# Altium schematic sheet Alimentacion.SchDoc
size A4
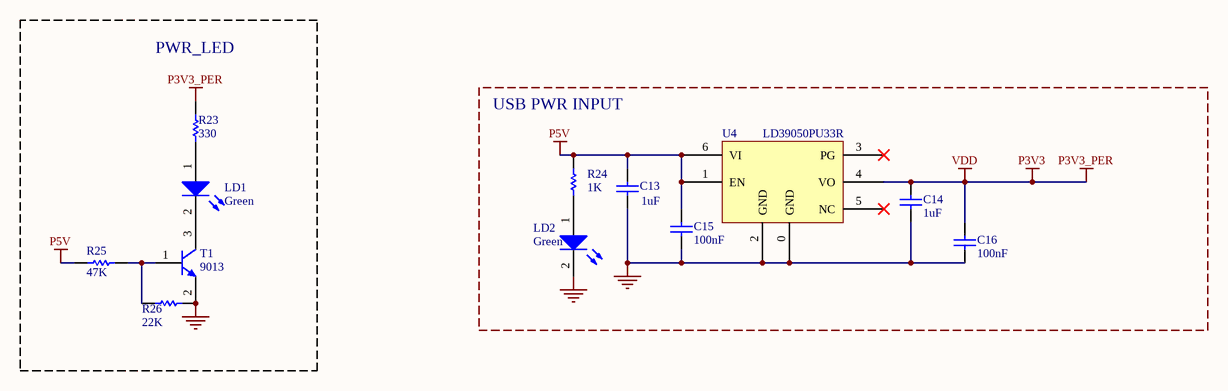
[diagram p0: Alimentacion.SchDoc]

## Parts
C13  1uF  [0603C]
C14  1uF  [0603C]
C15  100nF  [0603C]
C16  100nF  [0603C]
LD1  Green  [0603D-G]
LD2  Green  [0603D-G]
R23  330  [0603R]
R24  1K  [0603R]
R25  47K  [0603R]
R26  22K  [0603R]
T1  9013  [SOT-23]
U4  LD39050PU33R  [DFN6_0R95_3x3_TP]

## Blocks framed on the sheet
PWR_LED: LD1 R23 R25 R26 T1
USB PWR INPUT: C13-C16 LD2 R24 U4

## Nets
GND: C13.2 C14.2 C15.1 C16.1 LD2.2(K) R26.1 T1.2(E) U4.0(GND) U4.2(GND)
P3V3: C14.1 C16.2 R23.2 U4.4(VO)  [also labelled P3V3_PER, VDD]
P5V: C13.1 C15.2 R24.2 R25.1 U4.1(EN) U4.6(VI)
NetLD1_1: LD1.1(A) R23.1
NetLD1_2: LD1.2(K) T1.3(C)
NetLD2_1: LD2.1(A) R24.1
NetR25_2: R25.2 R26.2 T1.1(B)

Not connected (* = marked no-connect by the designer): U4 3(PG)* 5(NC)*

## Library data of the parts
C13 C14 = CAP SMD 0603  X5R 1µF 25V 10%: 0603  X5R 1µF; Rated voltage: 25V; Tolerance: 10%; Manufacturer: *; Manufacturer P/N: *; Order code Farnell: 1288202RL; Value: 1µF; Power: *; Technology: X5R; Temperature  Factor: *; Temperature Max: +125°C; Temperature Min: -55°C; STS Code: *
C15 C16 = Capacitor_ST: Capacitor 0402 / 0603 / 0805; Revision: July-2002: Re-released for DXP Platform.; Value: 100nF
LD1 LD2 = LED2: Typical RED, GREEN, YELLOW, AMBER GaAs LED; Published: 8-Jun-2000; Revision: July-2002: Re-released for DXP Platform.; Publisher: Altium Limited
R23 R25 R26 = res1: Resistor; Value: 1K; Published: 8-Jun-2000; Revision: July-2002: Re-released for DXP Platform.; Publisher: Altium Limited
R24 = Resistor_ST: Resistor 0402 / 0603 / 0805; Value: 10K
T1 = NPN: NPN Bipolar Transistor; Code - JEDEC: TO-226-AA; Published: 8-Jun-2000; Revision: July-2002: Re-released for DXP Platform.; Publisher: Altium Limited
U4 = LD39050P